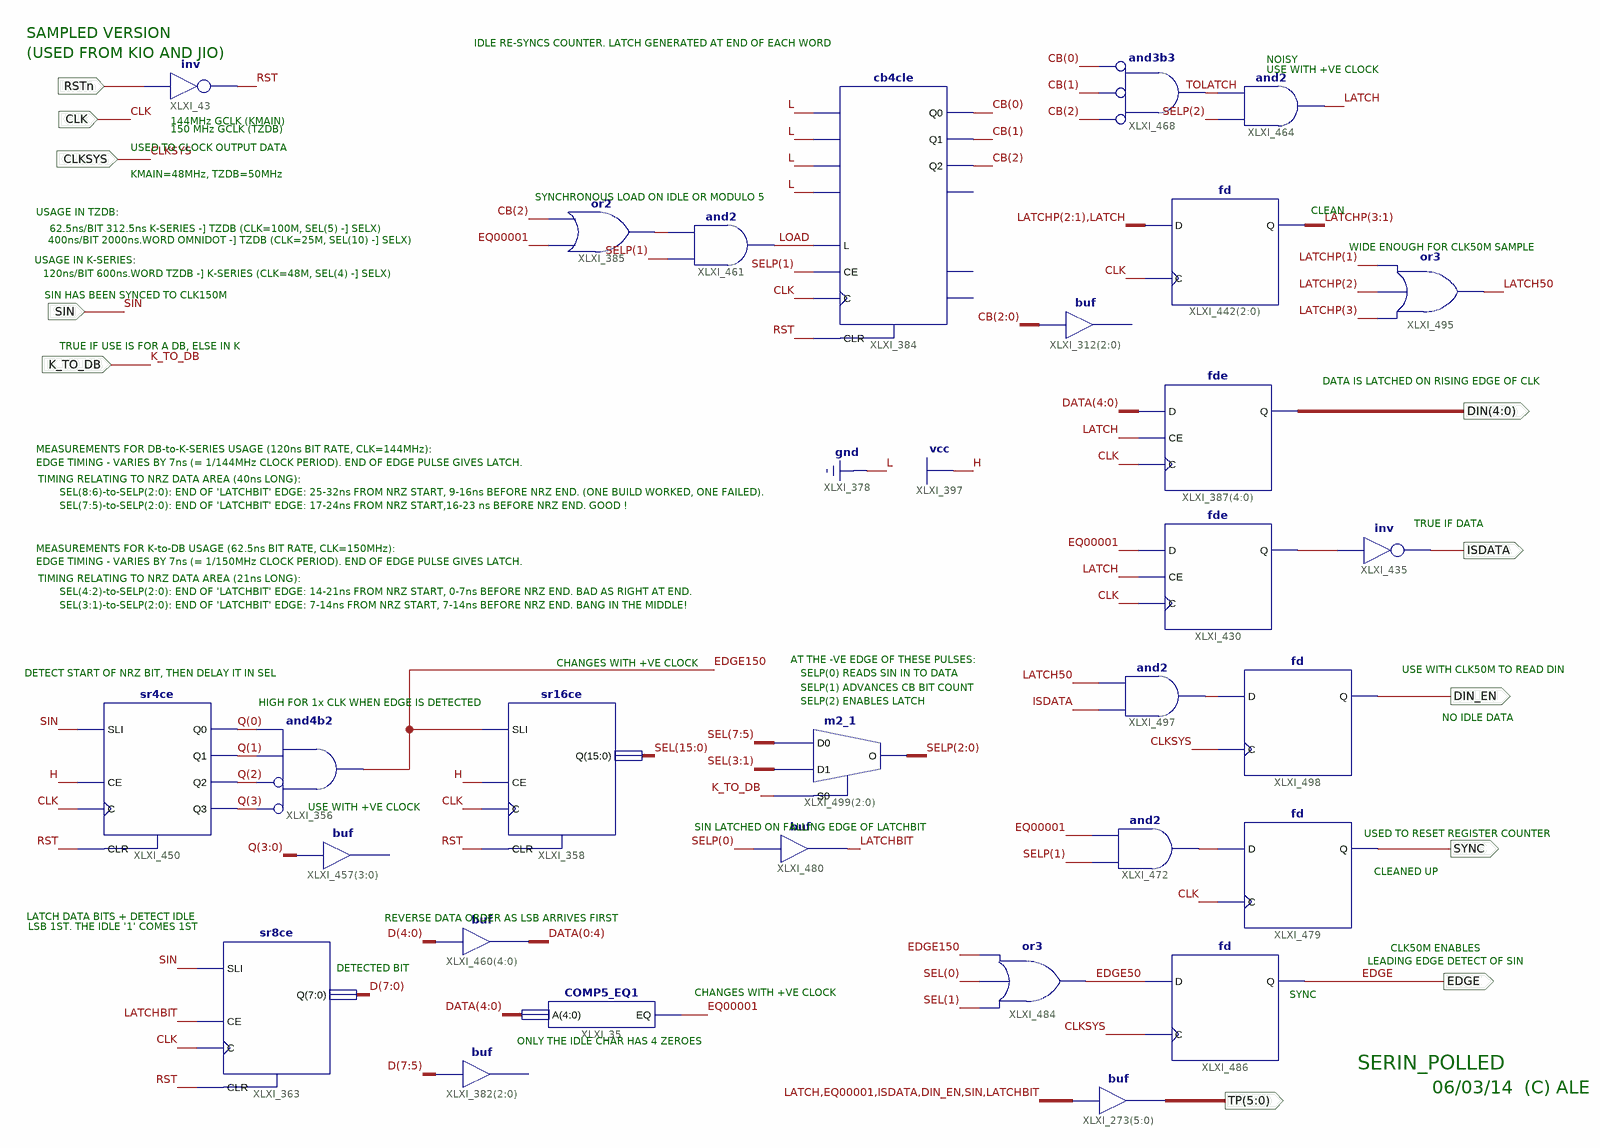
[diagram p0: schematic sheet 1]
// Xilinx ISE schematic SerIn_Polled.sch (spartan6) as structural Verilog: 29 symbols, 11 ports
module SerIn_Polled (
  input  CLK,
  input  SIN,
  input  CLKSYS,
  input  RSTn,
  input  K_TO_DB,
  output EDGE,
  output ISDATA,
  output SYNC,
  output [5:0] TP,
  output [4:0] DIN,
  output DIN_EN
);

  wire EDGE50, EDGE150, EQ00001, LATCH, LATCH50, LATCHBIT, LOAD, RST, TOLATCH, XLXN_874, XLXN_879, XLXN_916,
       XLXN_917;
  wire [2:0] CB, SELP;
  wire [3:0] Q;
  wire [3:1] LATCHP;
  wire [4:0] DATA;
  wire [7:0] D;
  wire [15:0] SEL;

  cb4cle XLXI_384 (
    .C(CLK), .CE(SELP[1]), .CLR(RST), .D0(1'b0), .D1(1'b0), .D2(1'b0), .D3(1'b0), .L(LOAD), .Q0(CB[0]),
    .Q1(CB[1]), .Q2(CB[2]));  // open: CEO, Q3, TC
  // buf XLXI_312[2..0] has open pins: I=CB, O=open
  fd XLXI_442[2:0] (.C(CLK), .D({LATCHP[2:1], LATCH}), .Q(LATCHP));
  COMP5_EQ1 XLXI_35 (.A(DATA), .EQ(EQ00001));
  // buf XLXI_382[2..0] has open pins: I=D[7:5], O=open
  and XLXI_356 (EDGE150, ~Q[3], ~Q[2], Q[1], Q[0]);  // and4b2
  sr4ce XLXI_450 (.C(CLK), .CE(1'b1), .CLR(RST), .SLI(SIN), .Q0(Q[0]), .Q1(Q[1]), .Q2(Q[2]), .Q3(Q[3]));
  sr16ce XLXI_358 (.C(CLK), .CE(1'b1), .CLR(RST), .SLI(EDGE150), .Q(SEL));
  // buf XLXI_457[3..0] has open pins: I=Q, O=open
  assign {DATA[0], DATA[1], DATA[2], DATA[3], DATA[4]} = D[4:0];  // buf XLXI_460[4..0], 5 bits wide
  and XLXI_461 (LOAD, SELP[1], XLXN_879);
  or XLXI_385 (XLXN_879, EQ00001, CB[2]);
  and XLXI_464 (LATCH, SELP[2], TOLATCH);
  and XLXI_468 (TOLATCH, ~CB[2], ~CB[1], ~CB[0]);  // and3b3
  sr8ce XLXI_363 (.C(CLK), .CE(LATCHBIT), .CLR(RST), .SLI(SIN), .Q(D));
  buf XLXI_480 (LATCHBIT, SELP[0]);
  fd XLXI_479 (.C(CLK), .D(XLXN_916), .Q(SYNC));
  and XLXI_472 (XLXN_916, SELP[1], EQ00001);
  assign TP = {LATCH, EQ00001, ISDATA, DIN_EN, SIN, LATCHBIT};  // buf XLXI_273[5..0], 6 bits wide
  fd XLXI_486 (.C(CLKSYS), .D(EDGE50), .Q(EDGE));
  or XLXI_484 (EDGE50, SEL[1], SEL[0], EDGE150);
  fde XLXI_387[4:0] (.C(CLK), .CE(LATCH), .D(DATA), .Q(DIN));
  fde XLXI_430 (.C(CLK), .CE(LATCH), .D(EQ00001), .Q(XLXN_874));
  not XLXI_435 (ISDATA, XLXN_874);
  not XLXI_43 (RST, RSTn);
  and XLXI_497 (XLXN_917, ISDATA, LATCH50);
  fd XLXI_498 (.C(CLKSYS), .D(XLXN_917), .Q(DIN_EN));
  or XLXI_495 (LATCH50, LATCHP[3], LATCHP[2], LATCHP[1]);
  m2_1 XLXI_499[2:0] (.D0(SEL[7:5]), .D1(SEL[3:1]), .S0(K_TO_DB), .O(SELP));

  // Notes on the sheet:
  //   SAMPLED VERSION
  //   IDLE RE-SYNCS COUNTER. LATCH GENERATED AT END OF EACH WORD
  //   (USED FROM KIO AND JIO)
  //   NOISY
  //   USE WITH +VE CLOCK
  //   144MHz GCLK (KMAIN)
  //   150 MHz GCLK (TZDB)
  //   USED TO CLOCK OUTPUT DATA
  //   KMAIN=48MHz, TZDB=50MHz
  //   SYNCHRONOUS LOAD ON IDLE OR MODULO 5
  //   CLEAN
  //   USAGE IN TZDB:
  //   62.5ns/BIT 312.5ns K-SERIES -] TZDB (CLK=100M, SEL(5) -] SELX)
  //   400ns/BIT 2000ns.WORD OMNIDOT -] TZDB (CLK=25M, SEL(10) -] SELX)
  //   WIDE ENOUGH FOR CLK50M SAMPLE
  //   USAGE IN K-SERIES:
  //   120ns/BIT 600ns.WORD TZDB -] K-SERIES (CLK=48M, SEL(4) -] SELX)
  //   SIN HAS BEEN SYNCED TO CLK150M
  //   TRUE IF USE IS FOR A DB, ELSE IN K
  //   DATA IS LATCHED ON RISING EDGE OF CLK
  //   MEASUREMENTS FOR DB-to-K-SERIES USAGE (120ns BIT RATE, CLK=144MHz):
  //   EDGE TIMING - VARIES BY 7ns (= 1/144MHz CLOCK PERIOD). END OF EDGE PULSE GIVES LATCH.
  //   TIMING RELATING TO NRZ DATA AREA (40ns LONG):
  //   SEL(8:6)-to-SELP(2:0): END OF 'LATCHBIT' EDGE: 25-32ns FROM NRZ START, 9-16ns BEFORE NRZ END. (ONE BUILD WORKED, ONE FAILED).
  //   SEL(7:5)-to-SELP(2:0): END OF 'LATCHBIT' EDGE: 17-24ns FROM NRZ START,16-23 ns BEFORE NRZ END. GOOD !
  //   TRUE IF DATA
  //   MEASUREMENTS FOR K-to-DB USAGE (62.5ns BIT RATE, CLK=150MHz):
  //   EDGE TIMING - VARIES BY 7ns (= 1/150MHz CLOCK PERIOD). END OF EDGE PULSE GIVES LATCH.
  //   TIMING RELATING TO NRZ DATA AREA (21ns LONG):
  //   SEL(4:2)-to-SELP(2:0): END OF 'LATCHBIT' EDGE: 14-21ns FROM NRZ START, 0-7ns BEFORE NRZ END. BAD AS RIGHT AT END.
  //   SEL(3:1)-to-SELP(2:0): END OF 'LATCHBIT' EDGE: 7-14ns FROM NRZ START, 7-14ns BEFORE NRZ END. BANG IN THE MIDDLE!
  //   AT THE -VE EDGE OF THESE PULSES:
  //   CHANGES WITH +VE CLOCK
  //   USE WITH CLK50M TO READ DIN
  //   DETECT START OF NRZ BIT, THEN DELAY IT IN SEL
  //   SELP(0) READS SIN IN TO DATA
  //   SELP(1) ADVANCES CB BIT COUNT
  //   SELP(2) ENABLES LATCH
  //   HIGH FOR 1x CLK WHEN EDGE IS DETECTED
  //   NO IDLE DATA
  //   USE WITH +VE CLOCK
  //   SIN LATCHED ON FALLING EDGE OF LATCHBIT
  //   USED TO RESET REGISTER COUNTER
  //   CLEANED UP
  //   LATCH DATA BITS + DETECT IDLE
  //   REVERSE DATA ORDER AS LSB ARRIVES FIRST
  //   LSB 1ST. THE IDLE '1' COMES 1ST
  //   CLK50M ENABLES
  //   LEADING EDGE DETECT OF SIN
  //   DETECTED BIT
  //   CHANGES WITH +VE CLOCK
  //   SYNC
  //   ONLY THE IDLE CHAR HAS 4 ZEROES
  //   SERIN_POLLED
  //   06/03/14  (C) ALE
endmodule
